# Altium schematic sheet Microcontroller.SchDoc
size A
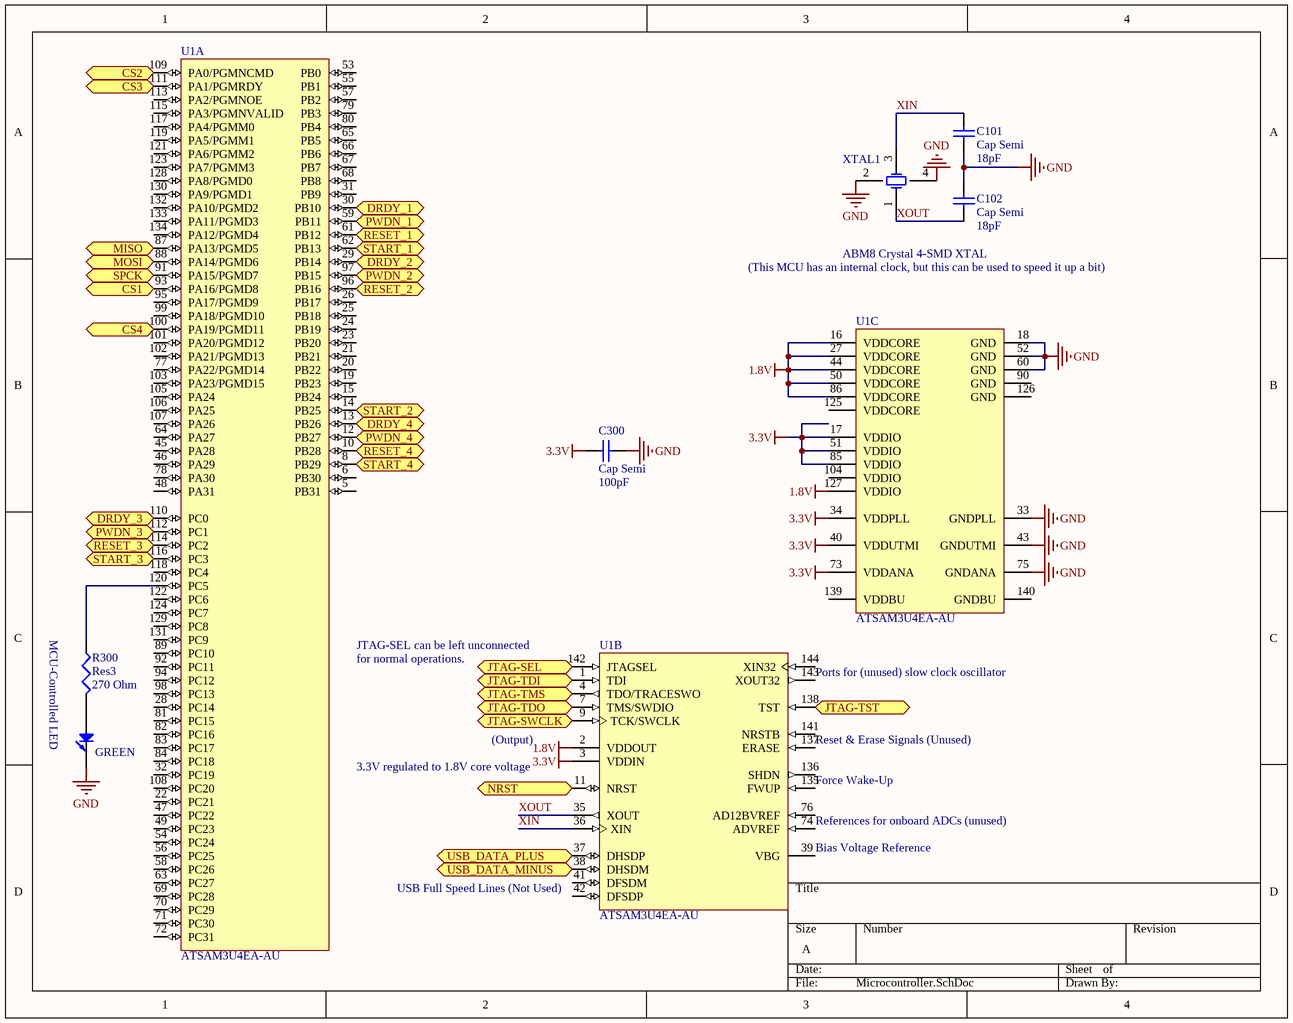
[diagram p0: Microcontroller.SchDoc]

## Parts
C101  Cap Semi  value 18pF  [1608[0603]]
C102  Cap Semi  value 18pF  [1608[0603]]
C300  Cap Semi  value 100pF  [C1206]
LED2  GREEN  [1608[0603]]
R300  Res3  value 270 Ohm  [1608[0603]]
U1  ATSAM3U4EA-AU  [144L1_N]  (parts A,B,C of 3)
XTAL1  ABM8 Crystal 4-SMD XTAL  [ABM8 Crystal XTAL]

## Ports
CS1, CS2, CS3, CS4, DRDY_1, DRDY_2, DRDY_3, DRDY_4, JTAG-SEL, JTAG-SWCLK, JTAG-TDI, JTAG-TDO, JTAG-TMS, JTAG-TST, MISO, MOSI, NRST, PWDN_1, PWDN_2, PWDN_3, PWDN_4, RESET_1, RESET_2, RESET_3, RESET_4, SPCK, START_1, START_2, START_3, START_4, USB_DATA_MINUS, USB_DATA_PLUS

## Nets
1.8V: U1.2(VDDOUT) U1.16(VDDCORE) U1.27(VDDCORE) U1.44(VDDCORE) U1.50(VDDCORE) U1.86(VDDCORE) U1.127(VDDIO)
3.3V: C300.1 U1.3(VDDIN) U1.17(VDDIO) U1.34(VDDPLL) U1.40(VDDUTMI) U1.51(VDDIO) U1.73(VDDANA) U1.85(VDDIO)
GND: C101.1 C102.2 C300.2 LED2.2(K) U1.18(GND) U1.33(GNDPLL) U1.43(GNDUTMI) U1.52(GND) U1.60(GND) U1.75(GNDANA) XTAL1.2(GND) XTAL1.4(GND)
CS1: U1.93(PA16/PGMD8) ; port CS1
CS2: U1.109(PA0/PGMNCMD) ; port CS2
CS3: U1.111(PA1/PGMRDY) ; port CS3
CS4: U1.100(PA19/PGMD11) ; port CS4
DRDY_1: U1.30(PB10) ; port DRDY_1
DRDY_2: U1.29(PB14) ; port DRDY_2
DRDY_3: U1.110(PC0) ; port DRDY_3
DRDY_4: U1.13(PB26) ; port DRDY_4
JTAG-SEL: U1.142(JTAGSEL) ; port JTAG-SEL
JTAG-SWCLK: U1.9(TCK/SWCLK) ; port JTAG-SWCLK
JTAG-TDI: U1.1(TDI) ; port JTAG-TDI
JTAG-TDO: U1.7(TMS/SWDIO) ; port JTAG-TDO
JTAG-TMS: U1.4(TDO/TRACESWO) ; port JTAG-TMS
JTAG-TST: U1.138(TST) ; port JTAG-TST
MISO: U1.87(PA13/PGMD5) ; port MISO
MOSI: U1.88(PA14/PGMD6) ; port MOSI
NRST: U1.11(NRST) ; port NRST
PWDN_1: U1.59(PB11) ; port PWDN_1
PWDN_2: U1.97(PB15) ; port PWDN_2
PWDN_3: U1.112(PC1) ; port PWDN_3
PWDN_4: U1.12(PB27) ; port PWDN_4
RESET_1: U1.61(PB12) ; port RESET_1
RESET_2: U1.96(PB16) ; port RESET_2
RESET_3: U1.114(PC2) ; port RESET_3
RESET_4: U1.10(PB28) ; port RESET_4
SPCK: U1.91(PA15/PGMD7) ; port SPCK
START_1: U1.62(PB13) ; port START_1
START_2: U1.14(PB25) ; port START_2
START_3: U1.116(PC3) ; port START_3
START_4: U1.8(PB29) ; port START_4
USB_DATA_MINUS: U1.38(DHSDM) ; port USB_DATA_MINUS
USB_DATA_PLUS: U1.37(DHSDP) ; port USB_DATA_PLUS
XIN: C101.2 U1.36(XIN) XTAL1.3(OSC2)
XOUT: C102.1 U1.35(XOUT) XTAL1.1(OSC1)
NetLED2_1: LED2.1(A) R300.2
NetR300_1: R300.1 U1.120(PC5)

Not connected (* = marked no-connect by the designer): U1 5(PB31) 6(PB30) 15(PB24) 19(PB23) 20(PB22) 21(PB21) 22(PC21) 23(PB20) 24(PB19) 25(PB18) 26(PB17) 28(PC14) 31(PB9) 32(PC19) 39(VBG) 41(DFSDM) 42(DFSDP) 45(PA28) 46(PA29) 47(PC22) 48(PA31) 49(PC23) 53(PB0) 54(PC24) 55(PB1) 56(PC25) 57(PB2) 58(PC26) 63(PC27) 64(PA27) 65(PB5) 66(PB6) 67(PB7) 68(PB8) 69(PC28) 70(PC29) 71(PC30) 72(PC31) 74(ADVREF) 76(AD12BVREF) 77(PA22/PGMD14) 78(PA30) 79(PB3) 80(PB4) 81(PC15) 82(PC16) 83(PC17) 84(PC18) 89(PC10) 90(GND) 92(PC11) 94(PC12) 95(PA17/PGMD9) 98(PC13) 99(PA18/PGMD10) 101(PA20/PGMD12) 102(PA21/PGMD13) 103(PA23/PGMD15) 104(VDDIO) 105(PA24) 106(PA25) 107(PA26) 108(PC20) 113(PA2/PGMNOE) 115(PA3/PGMNVALID) 117(PA4/PGMM0) 118(PC4) 119(PA5/PGMM1) 121(PA6/PGMM2) 122(PC6) 123(PA7/PGMM3) 124(PC7) 125(VDDCORE) 126(GND) 128(PA8/PGMD0) 129(PC8) 130(PA9/PGMD1) 131(PC9) 132(PA10/PGMD2) 133(PA11/PGMD3) 134(PA12/PGMD4) 135(FWUP) 136(SHDN) 137(ERASE) 139(VDDBU) 140(GNDBU) 141(NRSTB) 143(XOUT32) 144(XIN32)

## Notes on the sheet
- (This MCU has an internal clock, but this can be used to speed it up a bit)
- MCU-Controlled LED
- (near U1) JTAG-SEL can be left unconnected
- (near U1) for normal operations.
- (near U1) Ports for (unused) slow clock oscillator
- (near U1) 3.3V regulated to 1.8V core voltage
- (Output)
- (near U1) Reset & Erase Signals (Unused)
- (near U1) Force Wake-Up
- (near U1) References for onboard ADCs (unused)
- (near U1) USB Full Speed Lines (Not Used)
- (near U1) Bias Voltage Reference

## Library data of the parts
C101 C102 C300 = Cap Semi: Capacitor (Semiconductor SIM Model); Published: 8-Jun-2000; LatestRevisionDate: 29-May-2009; LatestRevisionNote: IPC-7351 Footprint Added.; PackageReference: C1206; Publisher: Altium Limited; PackageDescription: Chip Capacitor
LED2 = LED0: led; Manufacturer: Lite-On Inc; Manufacturer Part Number: LTST-C193KGKT-5A; Wavelength - Dominant: 572nm; Wavelength - Peak: 574nm; Millicandela Rating: 16.25mcd; Voltage - Forward (Vf) (Typ): 2V; Current - Test: 5mA; Viewing Angle: 130°; Lens Type: Clear; Lens Style/Size: Rectangle with Flat Top, 1.15mm x 0.8mm; Supplier 1: Digi-Key; Supplier Part Number 1: 160-1828-1-ND; RoHS: RoHS Compliant; Category: Optoelectronics; Stock 1: 69140; Pricing 1: 1=0.43, 10=0.315, 100=0.167, 250=0.11812, 500=0.1008, 1000=0.07875 (USD); Packaging: Cut Tape (CT); Color: Green; Package / Case: 0603 (1608 Metric); Size / Dimension: 1.60mm L x 0.80mm W; Height: 0.35mm; Mounting Type: Surface Mount; Luminous Flux @ Current - Test: -; ComponentLink1URL: http://optoelectronics.liteon.com/upload/download/DS22-2007-0094/S_110_LTST-C193KGKT-5A.pdf; ComponentLink1Description: http://optoelectronics.liteon.com/upload/download/DS22-2007-0094/S_110_LTST-C193KGKT-5A.pdf
R300 = Res3: Resistor; Published: 8-Jun-2000; LatestRevisionDate: 29-May-2009; LatestRevisionNote: IPC-7351 Footprint Added.; PackageReference: J1-0603; Publisher: Altium Limited; PackageDescription: Chip Resistor
U1 = ATSAM3U4EA-AU: AT91 ARM Cortex-M3 32-bit Microcontroller, 2x128KB Flash, 52KB SRAM, 96 User I/Os, 4USARTs, 144-Pin LQFP, Industrial Grade (-40°C to 85°C), Pb-Free; Published: 20-Sep-2010; DatasheetVersion: revC, Apr-2010; PackageVersion: rev.A, Nov-2001; PackageReference: 144L1; Publisher: Altium Limited; PackageDescription: 144-Pin Thin Quad Flat Pack 0.5 mm Pitch; Supplier 1: Digi-Key; Supplier Part Number 1: ATSAM3U4EA-AU-ND; Supplier 2: Mouser; Supplier Part Number 2: 556-ATSAM3U4EA-AU; Code_JEDEC: MS-026-BFB; ComponentLink1Description: Manufacturer Link; ComponentLink1URL: http://www.atmel.com/products/AT91/default.asp?; ComponentLink2Description: SAM3U Series Datasheet; ComponentLink2URL: http://www.atmel.com/dyn/resources/prod_documents/doc6430.pdf; ComponentLink3Description: SAM3U Series Summary; ComponentLink3URL: http://www.atmel.com/dyn/resources/prod_documents/6430s.pdf; ComponentLink4Description: Atmel.com Home; ComponentLink4URL: http://www.atmel.com
XTAL1 = ABM8 Crystal 4-SMD XTAL_1: SMD Crystal